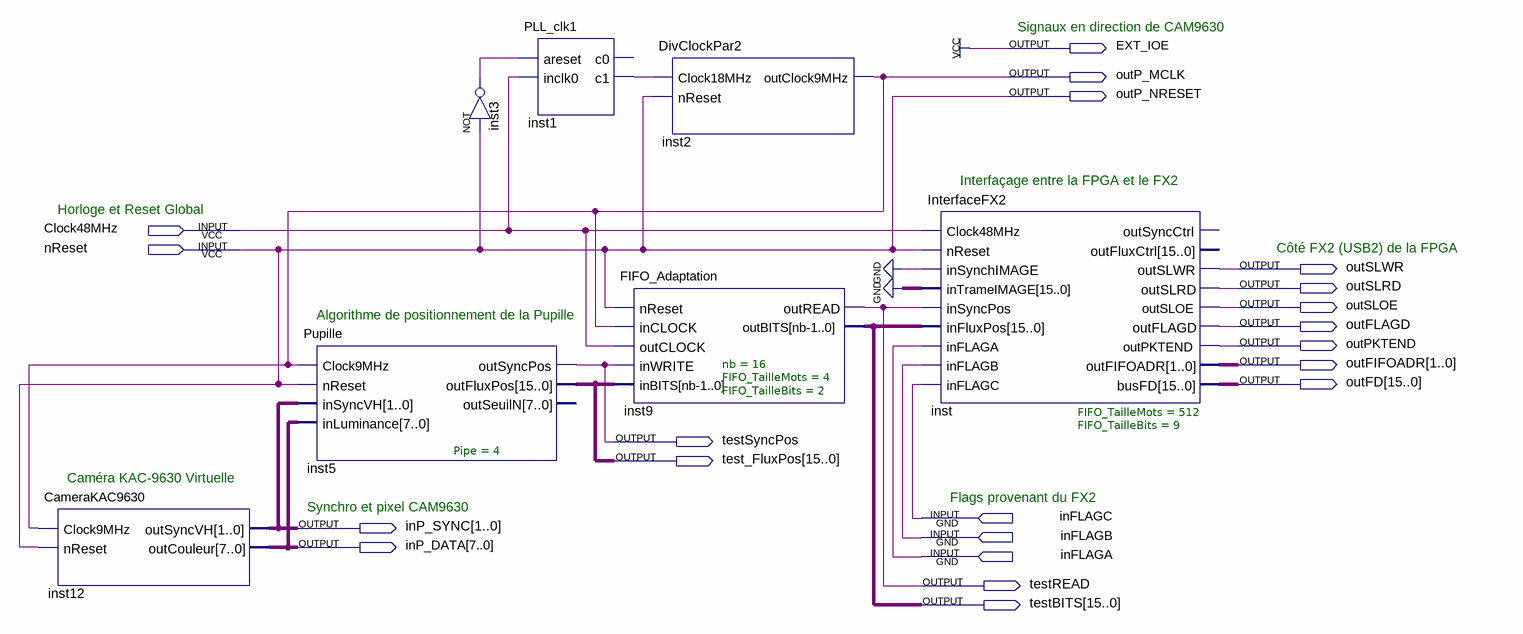
[diagram p0: schematic sheet]
// Quartus schematic VisionStereo_Pupille_TEST.bdf as structural Verilog: 7 symbols, 21 pins
module VisionStereo_Pupille_TEST (
  input  Clock48MHz,
  input  nReset,
  input  inFLAGC,
  input  inFLAGB,
  input  inFLAGA,
  output EXT_IOE,
  output outP_MCLK,
  output outP_NRESET,
  output outSLWR,
  output outSLRD,
  output outSLOE,
  output outFLAGD,
  output outPKTEND,
  output [1:0] outFIFOADR,
  output [15:0] outFD,
  output testSyncPos,
  output [15:0] test_FluxPos,
  output [1:0] inP_SYNC,
  output [7:0] inP_DATA,
  output testREAD,
  output [15:0] testBITS
);

  wire inst1_c1, inst3_out;

  CameraKAC9630 inst12 (.Clock9MHz(outP_MCLK), .nReset(nReset), .outSyncVH(inP_SYNC), .outCouleur(inP_DATA));
  Pupille #(.Pipe(4)) inst5 (
    .Clock9MHz(outP_MCLK), .nReset(nReset), .inSyncVH(inP_SYNC), .inLuminance(inP_DATA),
    .outSyncPos(testSyncPos), .outFluxPos(test_FluxPos));  // open: outSeuilN
  not inst3 (inst3_out, nReset);
  PLL_clk1 inst1 (.areset(inst3_out), .inclk0(Clock48MHz), .c1(inst1_c1));  // open: c0
  DivClockPar2 inst2 (.Clock18MHz(inst1_c1), .nReset(nReset), .outClock9MHz(outP_MCLK));
  FIFO_Adaptation #(.nb(16), .FIFO_TailleMots(4), .FIFO_TailleBits(2)) inst9 (
    .nReset(nReset), .inCLOCK(outP_MCLK), .outCLOCK(Clock48MHz), .inWRITE(testSyncPos),
    .inBITS(test_FluxPos), .outREAD(testREAD), .outBITS(testBITS));
  InterfaceFX2 #(.FIFO_TailleMots(512), .FIFO_TailleBits(9)) inst (
    .Clock48MHz(Clock48MHz), .nReset(nReset), .inSynchIMAGE(1'b0), .inTrameIMAGE({16{1'b0}}),
    .inSyncPos(testREAD), .inFluxPos(testBITS), .inFLAGA(inFLAGA), .inFLAGB(inFLAGB), .inFLAGC(inFLAGC),
    .outSLWR(outSLWR), .outSLRD(outSLRD), .outSLOE(outSLOE), .outFLAGD(outFLAGD), .outPKTEND(outPKTEND),
    .outFIFOADR(outFIFOADR), .busFD(outFD));  // open: outSyncCtrl, outFluxCtrl

  assign EXT_IOE = 1'b1;
  assign outP_NRESET = nReset;

  // Notes on the sheet:
  //   Signaux en direction de CAM9630
  //   Interfaçage entre la FPGA et le FX2
  //   Horloge et Reset Global
  //   Côté FX2 (USB2) de la FPGA
  //   Algorithme de positionnement de la Pupille
  //   Caméra KAC-9630 Virtuelle
  //   Flags provenant du FX2
  //   Synchro et pixel CAM9630
endmodule
